# Altium schematic sheet jetson-nano.SchDoc
size A3; SheetNumber: 2; SheetTotal: 8
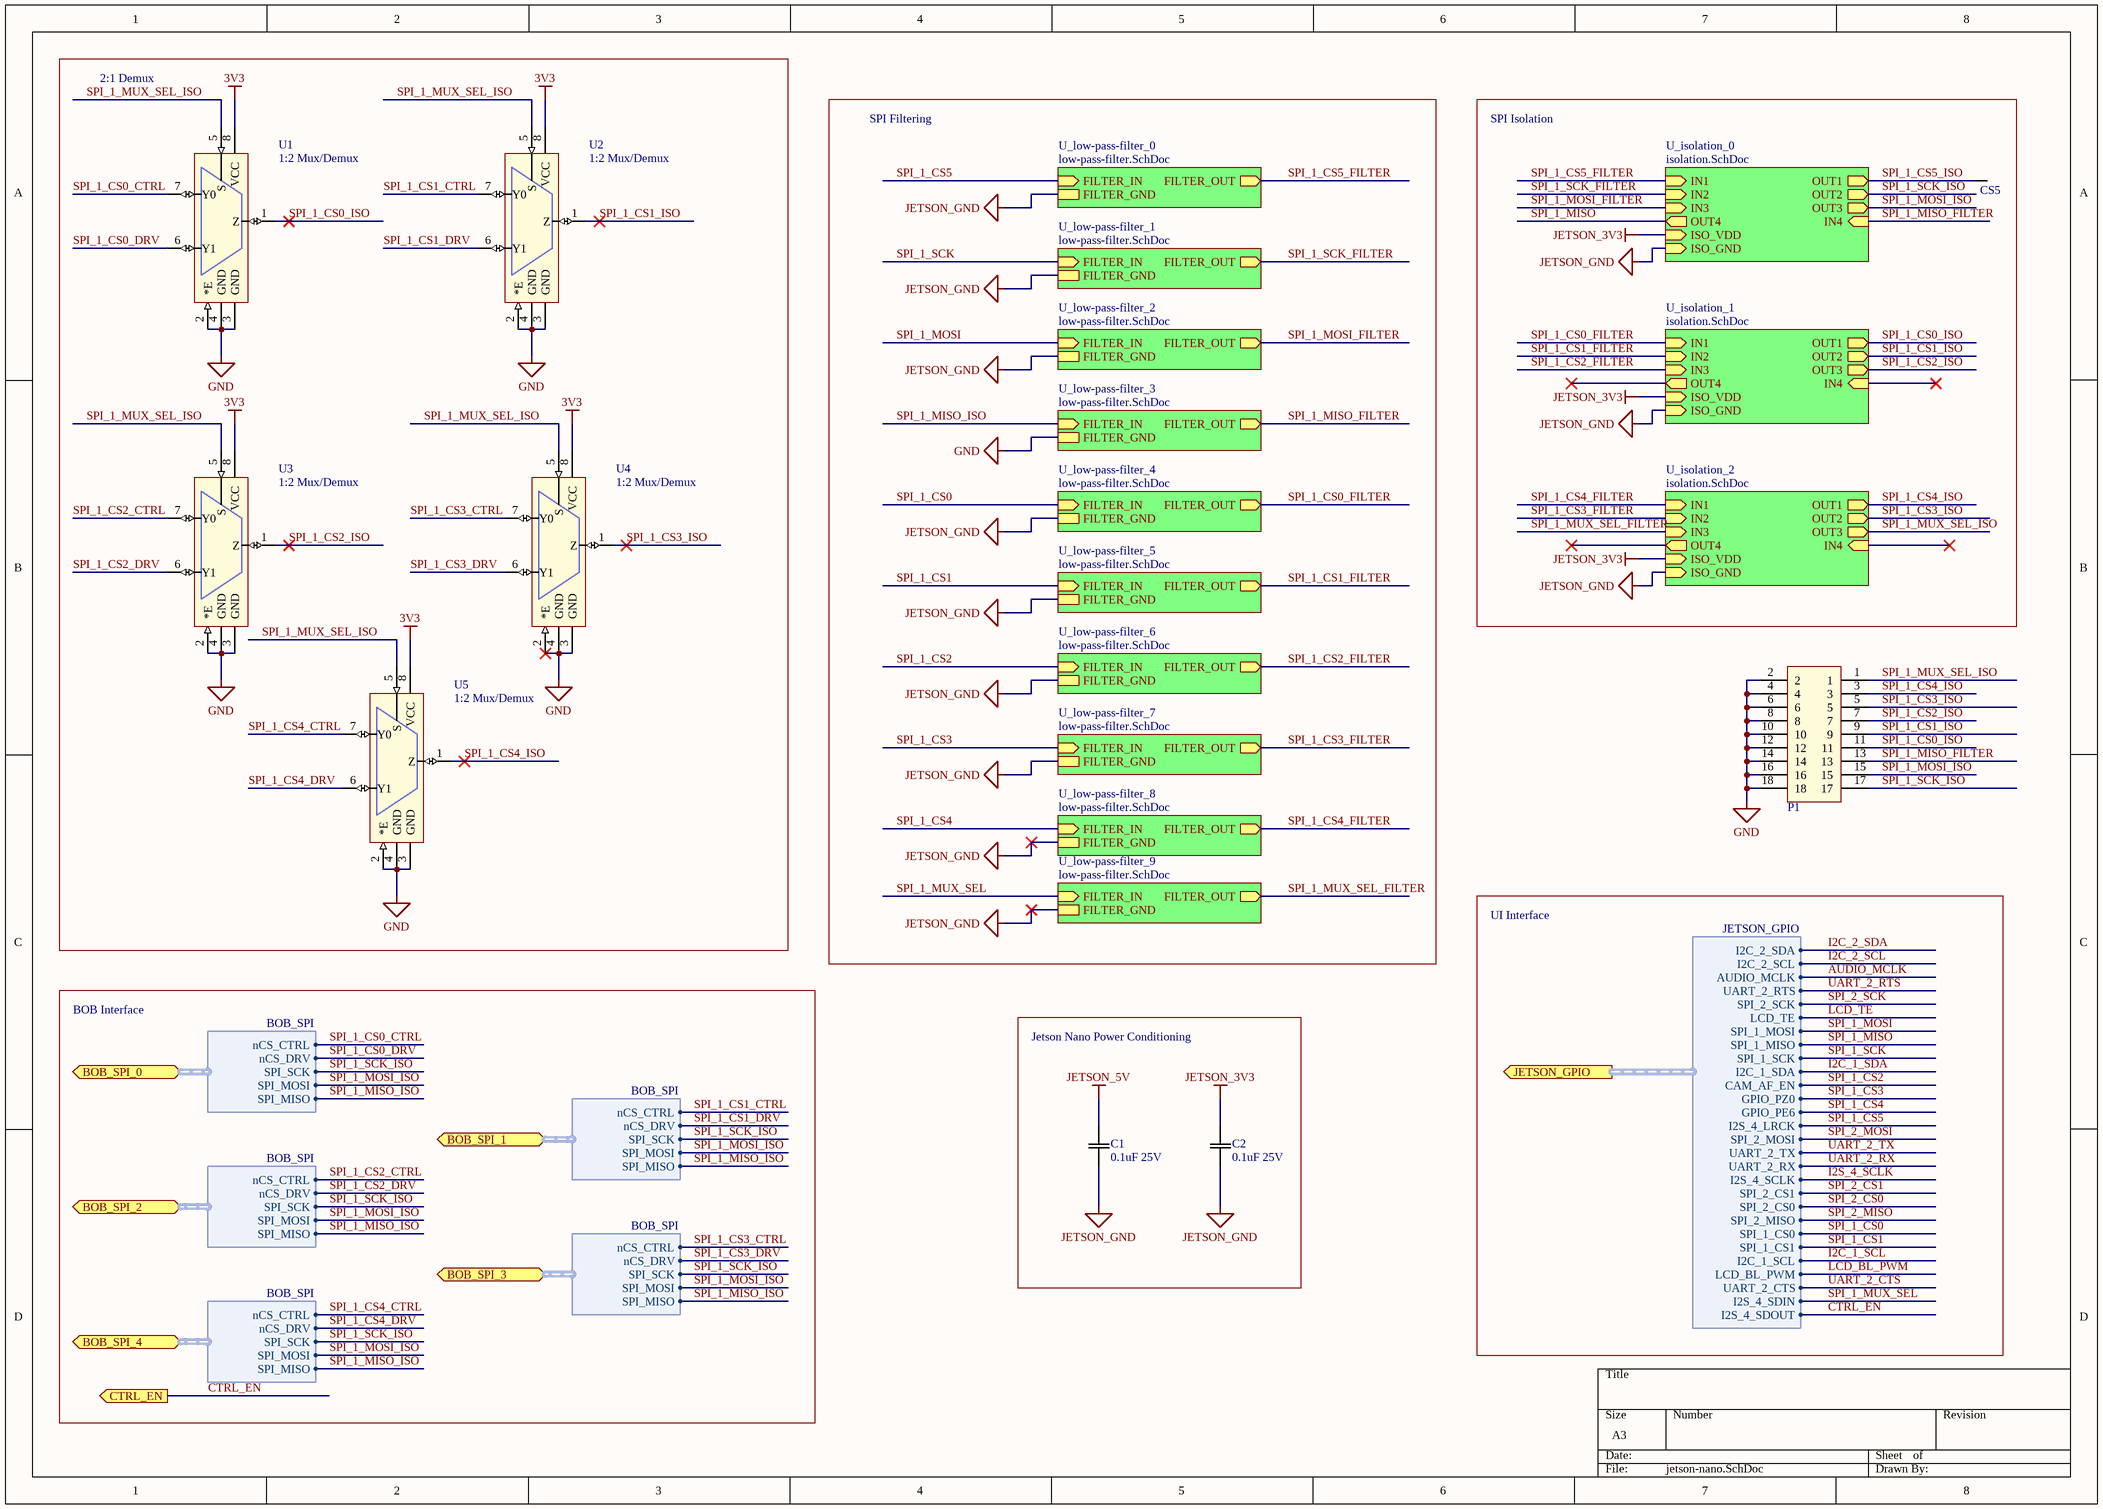
[diagram p0: jetson-nano.SchDoc]

## Parts
C1  0.1uF 25V  [0805]
C2  0.1uF 25V  [0805]
CS5  Test Point (Via)  [TP]  (value not drawn)
P1  CN HDR 18POS 2x9  [HDR2x9]  (value not drawn)
U1  1:2 Mux/Demux  [TSOP65P400X110-8N]
U2  1:2 Mux/Demux  [TSOP65P400X110-8N]
U3  1:2 Mux/Demux  [TSOP65P400X110-8N]
U4  1:2 Mux/Demux  [TSOP65P400X110-8N]
U5  1:2 Mux/Demux  [TSOP65P400X110-8N]

## Blocks framed on the sheet
2:1 Demux: U1-U5
SPI Isolation: CS5
Jetson Nano Power Conditioning: C1 C2

## Sub-sheets
U_isolation_0 = isolation.SchDoc: OUT1 (out), IN1 (in), IN2 (in), IN3 (in), OUT4 (out), OUT3 (out), OUT2 (out), IN4 (in), ISO_VDD (in), ISO_GND (in)
U_isolation_1 = isolation.SchDoc: OUT1 (out), IN1 (in), IN2 (in), IN3 (in), OUT4 (out), OUT3 (out), OUT2 (out), IN4 (in), ISO_VDD (in), ISO_GND (in)
U_isolation_2 = isolation.SchDoc: OUT1 (out), IN1 (in), IN2 (in), IN3 (in), OUT4 (out), OUT3 (out), OUT2 (out), IN4 (in), ISO_VDD (in), ISO_GND (in)
U_low-pass-filter_0 = low-pass-filter.SchDoc: FILTER_OUT (out), FILTER_IN (in), FILTER_GND
U_low-pass-filter_1 = low-pass-filter.SchDoc: FILTER_OUT (out), FILTER_IN (in), FILTER_GND
U_low-pass-filter_2 = low-pass-filter.SchDoc: FILTER_OUT (out), FILTER_IN (in), FILTER_GND
U_low-pass-filter_3 = low-pass-filter.SchDoc: FILTER_OUT (out), FILTER_IN (in), FILTER_GND
U_low-pass-filter_4 = low-pass-filter.SchDoc: FILTER_OUT (out), FILTER_IN (in), FILTER_GND
U_low-pass-filter_5 = low-pass-filter.SchDoc: FILTER_OUT (out), FILTER_IN (in), FILTER_GND
U_low-pass-filter_6 = low-pass-filter.SchDoc: FILTER_OUT (out), FILTER_IN (in), FILTER_GND
U_low-pass-filter_7 = low-pass-filter.SchDoc: FILTER_OUT (out), FILTER_IN (in), FILTER_GND
U_low-pass-filter_8 = low-pass-filter.SchDoc: FILTER_OUT (out), FILTER_IN (in), FILTER_GND
U_low-pass-filter_9 = low-pass-filter.SchDoc: FILTER_OUT (out), FILTER_IN (in), FILTER_GND

## Ports
BOB_SPI_0 (bidir, harness BOB_SPI), BOB_SPI_1 (bidir, harness BOB_SPI), BOB_SPI_2 (bidir, harness BOB_SPI), BOB_SPI_3 (bidir, harness BOB_SPI), BOB_SPI_4 (bidir, harness BOB_SPI), CTRL_EN (out), JETSON_GPIO (out, harness JETSON_GPIO)

## Harnesses
BOB_SPI: nCS_CTRL, nCS_DRV, SPI_SCK, SPI_MOSI, SPI_MISO
JETSON_GPIO: I2C_2_SDA, I2C_2_SCL, AUDIO_MCLK, UART_2_RTS, SPI_2_SCK, LCD_TE, SPI_1_MOSI, SPI_1_MISO, SPI_1_SCK, I2C_1_SDA, CAM_AF_EN, GPIO_PZ0, GPIO_PE6, I2S_4_LRCK, SPI_2_MOSI, UART_2_TX, UART_2_RX, I2S_4_SCLK, SPI_2_CS1, SPI_2_CS0, SPI_2_MISO, SPI_1_CS0, SPI_1_CS1, I2C_1_SCL, LCD_BL_PWM, UART_2_CTS, I2S_4_SDIN, I2S_4_SDOUT

## Nets
3V3: U1.8(VCC) U2.8(VCC) U3.8(VCC) U4.8(VCC) U5.8(VCC)
GND: P1.2 P1.4 P1.6 P1.8 P1.10 P1.12 P1.14 P1.16 P1.18 U1.2(*E) U1.3(GND) U1.4(GND) U2.2(*E) U2.3(GND) U2.4(GND) U3.2(*E) U3.3(GND) U3.4(GND) U4.2(*E) U4.3(GND) U4.4(GND) U5.2(*E) U5.3(GND) U5.4(GND) ; sheet U_low-pass-filter_3/FILTER_GND
JETSON_3V3: C2.1(C1) ; sheet U_isolation_0/ISO_VDD, sheet U_isolation_1/ISO_VDD, sheet U_isolation_2/ISO_VDD
JETSON_5V: C1.1(C1)
JETSON_GND: C1.2(C2) C2.2(C2) ; sheet U_isolation_0/ISO_GND, sheet U_isolation_1/ISO_GND, sheet U_isolation_2/ISO_GND, sheet U_low-pass-filter_0/FILTER_GND, sheet U_low-pass-filter_1/FILTER_GND, sheet U_low-pass-filter_2/FILTER_GND, sheet U_low-pass-filter_4/FILTER_GND, sheet U_low-pass-filter_5/FILTER_GND, sheet U_low-pass-filter_6/FILTER_GND, sheet U_low-pass-filter_7/FILTER_GND, sheet U_low-pass-filter_8/FILTER_GND, sheet U_low-pass-filter_9/FILTER_GND
AUDIO_MCLK: port JETSON_GPIO.AUDIO_MCLK
CTRL_EN: port CTRL_EN, port JETSON_GPIO.I2S_4_SDOUT
I2C_1_SCL: port JETSON_GPIO.I2C_1_SCL
I2C_1_SDA: port JETSON_GPIO.I2C_1_SDA
I2C_2_SCL: port JETSON_GPIO.I2C_2_SCL
I2C_2_SDA: port JETSON_GPIO.I2C_2_SDA
I2S_4_SCLK: port JETSON_GPIO.I2S_4_SCLK
LCD_BL_PWM: port JETSON_GPIO.LCD_BL_PWM
LCD_TE: port JETSON_GPIO.LCD_TE
SPI_1_CS0: sheet U_low-pass-filter_4/FILTER_IN, port JETSON_GPIO.SPI_1_CS0
SPI_1_CS0_CTRL: U1.7(Y0) ; port BOB_SPI_0.nCS_CTRL
SPI_1_CS0_DRV: U1.6(Y1) ; port BOB_SPI_0.nCS_DRV
SPI_1_CS0_FILTER: sheet U_isolation_1/IN1, sheet U_low-pass-filter_4/FILTER_OUT
SPI_1_CS0_ISO: P1.11 U1.1(Z) ; sheet U_isolation_1/OUT1
SPI_1_CS1: sheet U_low-pass-filter_5/FILTER_IN, port JETSON_GPIO.SPI_1_CS1
SPI_1_CS1_CTRL: U2.7(Y0) ; port BOB_SPI_1.nCS_CTRL
SPI_1_CS1_DRV: U2.6(Y1) ; port BOB_SPI_1.nCS_DRV
SPI_1_CS1_FILTER: sheet U_isolation_1/IN2, sheet U_low-pass-filter_5/FILTER_OUT
SPI_1_CS1_ISO: P1.9 U2.1(Z) ; sheet U_isolation_1/OUT2
SPI_1_CS2: sheet U_low-pass-filter_6/FILTER_IN, port JETSON_GPIO.CAM_AF_EN
SPI_1_CS2_CTRL: U3.7(Y0) ; port BOB_SPI_2.nCS_CTRL
SPI_1_CS2_DRV: U3.6(Y1) ; port BOB_SPI_2.nCS_DRV
SPI_1_CS2_FILTER: sheet U_isolation_1/IN3, sheet U_low-pass-filter_6/FILTER_OUT
SPI_1_CS2_ISO: P1.7 U3.1(Z) ; sheet U_isolation_1/OUT3
SPI_1_CS3: sheet U_low-pass-filter_7/FILTER_IN, port JETSON_GPIO.GPIO_PZ0
SPI_1_CS3_CTRL: U4.7(Y0) ; port BOB_SPI_3.nCS_CTRL
SPI_1_CS3_DRV: U4.6(Y1) ; port BOB_SPI_3.nCS_DRV
SPI_1_CS3_FILTER: sheet U_isolation_2/IN2, sheet U_low-pass-filter_7/FILTER_OUT
SPI_1_CS3_ISO: P1.5 U4.1(Z) ; sheet U_isolation_2/OUT2
SPI_1_CS4: sheet U_low-pass-filter_8/FILTER_IN, port JETSON_GPIO.GPIO_PE6
SPI_1_CS4_CTRL: U5.7(Y0) ; port BOB_SPI_4.nCS_CTRL
SPI_1_CS4_DRV: U5.6(Y1) ; port BOB_SPI_4.nCS_DRV
SPI_1_CS4_FILTER: sheet U_isolation_2/IN1, sheet U_low-pass-filter_8/FILTER_OUT
SPI_1_CS4_ISO: P1.3 U5.1(Z) ; sheet U_isolation_2/OUT1
SPI_1_CS5: sheet U_low-pass-filter_0/FILTER_IN, port JETSON_GPIO.I2S_4_LRCK
SPI_1_CS5_FILTER: sheet U_isolation_0/IN1, sheet U_low-pass-filter_0/FILTER_OUT
SPI_1_CS5_ISO: CS5.1 ; sheet U_isolation_0/OUT1
SPI_1_MISO: sheet U_isolation_0/OUT4, port JETSON_GPIO.SPI_1_MISO
SPI_1_MISO_FILTER: P1.13 ; sheet U_isolation_0/IN4, sheet U_low-pass-filter_3/FILTER_OUT
SPI_1_MISO_ISO: sheet U_low-pass-filter_3/FILTER_IN, port BOB_SPI_0.SPI_MISO, port BOB_SPI_2.SPI_MISO, port BOB_SPI_1.SPI_MISO, port BOB_SPI_3.SPI_MISO, port BOB_SPI_4.SPI_MISO
SPI_1_MOSI: sheet U_low-pass-filter_2/FILTER_IN, port JETSON_GPIO.SPI_1_MOSI
SPI_1_MOSI_FILTER: sheet U_isolation_0/IN3, sheet U_low-pass-filter_2/FILTER_OUT
SPI_1_MOSI_ISO: P1.15 ; sheet U_isolation_0/OUT3, port BOB_SPI_0.SPI_MOSI, port BOB_SPI_2.SPI_MOSI, port BOB_SPI_1.SPI_MOSI, port BOB_SPI_3.SPI_MOSI, port BOB_SPI_4.SPI_MOSI
SPI_1_MUX_SEL: sheet U_low-pass-filter_9/FILTER_IN, port JETSON_GPIO.I2S_4_SDIN
SPI_1_MUX_SEL_FILTER: sheet U_isolation_2/IN3, sheet U_low-pass-filter_9/FILTER_OUT
SPI_1_MUX_SEL_ISO: P1.1 U1.5(S) U2.5(S) U3.5(S) U4.5(S) U5.5(S) ; sheet U_isolation_2/OUT3
SPI_1_SCK: sheet U_low-pass-filter_1/FILTER_IN, port JETSON_GPIO.SPI_1_SCK
SPI_1_SCK_FILTER: sheet U_isolation_0/IN2, sheet U_low-pass-filter_1/FILTER_OUT
SPI_1_SCK_ISO: P1.17 ; sheet U_isolation_0/OUT2, port BOB_SPI_0.SPI_SCK, port BOB_SPI_2.SPI_SCK, port BOB_SPI_1.SPI_SCK, port BOB_SPI_3.SPI_SCK, port BOB_SPI_4.SPI_SCK
SPI_2_CS0: port JETSON_GPIO.SPI_2_CS0
SPI_2_CS1: port JETSON_GPIO.SPI_2_CS1
SPI_2_MISO: port JETSON_GPIO.SPI_2_MISO
SPI_2_MOSI: port JETSON_GPIO.SPI_2_MOSI
SPI_2_SCK: port JETSON_GPIO.SPI_2_SCK
UART_2_CTS: port JETSON_GPIO.UART_2_CTS
UART_2_RTS: port JETSON_GPIO.UART_2_RTS
UART_2_RX: port JETSON_GPIO.UART_2_RX
UART_2_TX: port JETSON_GPIO.UART_2_TX

## Notes on the sheet
- SPI Filtering
- UI Interface
- BOB Interface

## Library data of the parts
C1 C2 = CAP 0.1uF 25V: CAP CER 0.1UF 25V X7R 0805/0603; Tolerance: 10%; Value: 0.1uF; Temperature Coefficient: X7R; Rating: 25V; Operating Temperature: -55°C ~ 125°C
U1-U5 = 74LVC1G53DP,125: 74LVC Series 5.5 V SMT 2-Channel Analog Multiplexer/Demultiplexer - TSSOP-8; Manufacturer: NXP Semiconductors; Min Supply Voltage: 1.65V; Max Supply Voltage: 5.5V; Number of Channels: 2; Bandwidth: 300MHz; Propagation Delay: 0.8ns; Max Power Dissipation: 250mW; On-State Resistance: 15R; Turn-On Delay Time: 6.7ns; Turn-Off Delay Time: 6.8ns; Operating Supply Current: 40uA; Number of Outputs: 1; Logic Function: Multiplexer,Demultiplexer,Mux,Demux; Supply Type: Single; Supplier 1: Digi-Key; Manufacturer Part Number: 74LVC1G53DP,125; RoHS: Yes; Category: Decoders and Multiplexers; Mount: Surface Mount; Case/Package: TSSOP; Number of Pins: 8; Min Operating Temperature: -40°C; Max Operating Temperature: 125°C; Packaging: Tape and Reel; Package Quantity: 3000; Number of Inputs: 2; Power Dissipation: 250mW; Number of Circuits: 1; Number of Switches: 1; Series: 74LVC; Number of Functions: 1; Supply Voltage-Nom: 5.5V; Radiation Hardening: No; RoHS Compliant: Yes; REACH SVHC: No SVHC; Lead Free: Lead Free; ComponentLink1URL: https://datasheet.ciiva.com/2979/74lvc1g53-2979089.pdf?src-supplier=Arrow+Electronics; ComponentLink1Description: https://datasheet.ciiva.com/2979/74lvc1g53-2979089.pdf?src-supplier=Arrow+Electronics; ComponentLink2URL: https://datasheet.ciiva.com/2979/74lvc1g53-2979091.pdf?src-supplier=Avnet; ComponentLink2Description: https://datasheet.ciiva.com/2979/74lvc1g53-2979091.pdf?src-supplier=Avnet; ComponentLink3URL: https://datasheet.ciiva.com/2980/74lvc1g53-2980513.pdf?src-supplier=Avnet; ComponentLink3Description: https://datasheet.ciiva.com/2980/74lvc1g53-2980513.pdf?src-supplier=Avnet; ComponentLink4URL: https://datasheet.ciiva.com/1667/74lvc1g53-1667421.pdf?src-supplier=Digi-Key; ComponentLink4Description: https://datasheet.ciiva.com/1667/74lvc1g53-1667421.pdf?src-supplier=Digi-Key; ComponentLink5URL: https://datasheet.ciiva.com/1667/74lvc1g53-1667422.pdf?src-supplier=Digi-Key; ComponentLink5Description: https://datasheet.ciiva.com/1667/74lvc1g53-1667422.pdf?src-supplier=Digi-Key; ComponentLink6URL: https://datasheet.ciiva.com/1667/74lvc1g53-1667423.pdf?src-supplier=Digi-Key; ComponentLink6Description: https://datasheet.ciiva.com/1667/74lvc1g53-1667423.pdf?src-supplier=Digi-Key; ComponentLink7URL: https://datasheet.ciiva.com/16393/74lvc1g53-16393237.pdf?src-supplier=Future+Electronics; ComponentLink7Description: https://datasheet.ciiva.com/16393/74lvc1g53-16393237.pdf?src-supplier=Future+Electronics; ComponentLink8URL: https://datasheet.ciiva.com/46404/1759244-46404166.pdf?src-supplier=Element14; ComponentLink8Description: https://datasheet.ciiva.com/46404/1759244-46404166.pdf?src-supplier=Element14; Supplier Part Number 1: 1727-6078-1-ND